# EAGLE design wigl_sch_motors (EAGLE 7.2.0)
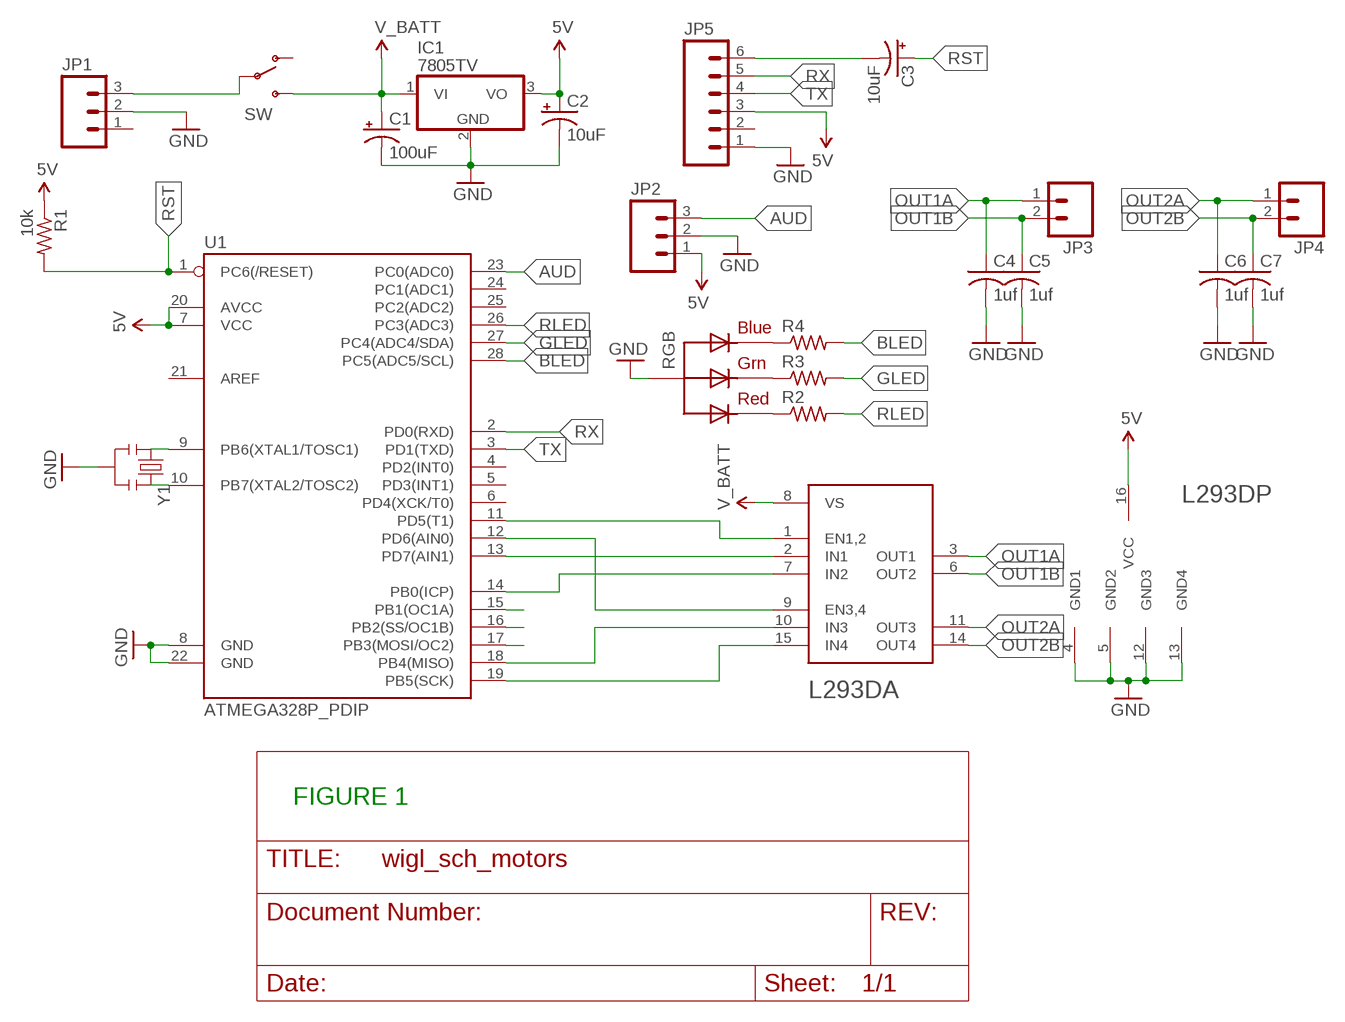
[diagram p0: schematic, sheet 1]

## Parts
C1  100uF  CAP_POLPTH1  [CPOL-RADIAL-100UF-25V]
C2  10uF  CAP_POLPTH1  [CPOL-RADIAL-100UF-25V]
C3  10uF  CAP_POLPTH1  [CPOL-RADIAL-100UF-25V]
C4  1uf  C-US025-025X050  [C025-025X050]
C5  1uf  C-US025-025X050  [C025-025X050]
C6  1uf  C-US025-025X050  [C025-025X050]
C7  1uf  C-US025-025X050  [C025-025X050]
IC1  7805TV  [TO220V]
JP1  M03LONGPADS  [1X03_LONGPADS]
JP2  M03LONGPADS  [1X03_LONGPADS]
JP3  M02LOCK_LONGPADS  [1X02_LOCK_LONGPADS]
JP4  M02LOCK_LONGPADS  [1X02_LOCK_LONGPADS]
JP5  M06LONGPADS  [1X06_LONGPADS]
L293D  L293D  [DIP16]
R1  10k  R-US_0204/2V  [0204V]
R2  R-US_0204/2V  [0204V]
R3  R-US_0204/2V  [0204V]
R4  R-US_0204/2V  [0204V]
RGB  RGBLED_CA-5MM  [LED5MMRGB]
SW  SWITCH-SPDTPTH  [SWITCH-SPDT]
U1  ATMEGA328P_PDIP  [DIL28-3]
Y1  RESONATORPTH  [RESONATOR-PTH]

## Nets
5V: C2.1(+) IC1.3(VO) JP2.1 JP5.3 L293D.16(P:VCC) R1.1 U1.7(VCC) U1.20(AVCC)
AUD: JP2.3 U1.23(PC0(ADC0))
BLED: R4.2 U1.28(PC5(ADC5/SCL))
GLED: R3.2 U1.27(PC4(ADC4/SDA))
GND: C1.2(-) C2.2(-) C4.2 C5.2 C6.2 C7.2 IC1.2(GND) JP1.2 JP2.2 L293D.4(P:GND1) L293D.5(P:GND2) L293D.12(P:GND3) L293D.13(P:GND4) RGB.2(VCC) U1.8(GND) U1.22(GND) Y1.2
N$1: JP1.3 SW.2(P)
N$2: R4.1 RGB.4(BLUE)
N$3: R3.1 RGB.3(GREEN)
N$4: C3.2(-) JP5.6
N$5: U1.9(PB6(XTAL1/TOSC1)) Y1.1
N$6: U1.10(PB7(XTAL2/TOSC2)) Y1.3
N$7: L293D.9(A:EN3,4) U1.12(PD6(AIN0))
N$8: R2.1 RGB.1(RED)
N$9: L293D.2(A:IN1) U1.13(PD7(AIN1))
N$10: L293D.7(A:IN2) U1.14(PB0(ICP))
N$11: U1.15(PB1(OC1A))
N$12: U1.16(PB2(SS/OC1B))
N$13: U1.17(PB3(MOSI/OC2))
N$14: L293D.10(A:IN3) U1.18(PB4(MISO))
N$15: L293D.15(A:IN4) U1.19(PB5(SCK))
N$16: L293D.1(A:EN1,2) U1.11(PD5(T1))
OUT1A: C4.1 JP3.1 L293D.3(A:OUT1)
OUT1B: C5.1 JP3.2 L293D.6(A:OUT2)
OUT2A: C6.1 JP4.1 L293D.11(A:OUT3)
OUT2B: C7.1 JP4.2 L293D.14(A:OUT4)
RLED: R2.2 U1.26(PC3(ADC3))
RST: C3.1(+) R1.2 U1.1(PC6(/RESET))
RX: JP5.5 U1.2(PD0(RXD))
TX: JP5.4 U1.3(PD1(TXD))
V_BATT: C1.1(+) IC1.1(VI) L293D.8(A:VS) SW.3(S)
Unconnected: JP1.1 JP5.1 JP5.2 SW.1(O) U1.4(PD2(INT0)) U1.5(PD3(INT1)) U1.6(PD4(XCK/T0)) U1.21(AREF) U1.24(PC1(ADC1)) U1.25(PC2(ADC2))

## Notes on the sheet
- FIGURE 1

## Library data of the parts
C1 C2 = SparkFun-Capacitors:CAP_POL: Capacitor Polarized These are standard SMD and PTH capacitors. Normally 10uF, 47uF, and 100uF in electrolytic and tantalum varieties. Always verify the external diameter of the through hole cap, it varies with capacity, voltage, and manufacturer. The EIA devices should be standard.
C3 = SparkFun-Passives:CAP_POL: Capacitor Polarized These are standard SMD and PTH capacitors. Normally 10uF, 47uF, and 100uF in electrolytic and tantalum varieties. Always verify the external diameter of the through hole cap, it varies with capacity, voltage, and manufacturer. The EIA devices should be standard.
C4-C7 = adafruit:C-US: CAPACITOR, American symbol
IC1 = linear:78*: Positive VOLTAGE REGULATOR Source: http://cache.national.com/ds/LM/LM78L05.pdf http://www.fairchildsemi.com/ds/LM/LM7805.pdf
JP1 JP2 = SparkFun-Connectors:M03: Header 3 Standard 3-pin 0.1" header. Use with straight break away headers (SKU : PRT-00116), right angle break away headers (PRT-00553), swiss pins (PRT-00743), machine pins (PRT-00117), and female headers (PRT-00115). Molex polarized connector foot print use with SKU : PRT-08232 with associated crimp pins and housings.
JP3 JP4 = SparkFun-Connectors:M02: Standard 2-pin 0.1" header. Use with - straight break away headers ( PRT-00116) - right angle break away headers (PRT-00553) - swiss pins (PRT-00743) - machine pins (PRT-00117) - female headers (PRT-00115) Molex polarized connector foot print use with: PRT-08233 with associated crimp pins and housings. 2.54_SCREWTERM for use with PRT-10571. 3.5mm Screw Terminal footprints for PRT-08084 5mm Screw Terminal footprints for use with PRT-08432
JP5 = SparkFun-Connectors:M06: Header 6 Standard 6-pin 0.1" header. Use with straight break away headers (SKU : PRT-00116), right angle break away headers (PRT-00553), swiss pins (PRT-00743), machine pins (PRT-00117), and female headers (PRT-00115). Molex polarized connector foot print use with SKU : PRT-08094 with associated crimp pins and housings. NOTES ON THE VARIANTS LOCK and LOCK_LONGPADS... This footprint was designed to help hold the alignment of a through-hole component (i.e. 6-pin header) while soldering it into place. You may notice that each hole has been shifted either up or down by 0.005 of an inch from it's more standard position (which is a perfectly straight line). This slight alteration caused the pins (the squares in the middle) to touch the edges of the holes. Because they are alternating, it causes a "brace" to hold the component in place. 0.005 has proven to be the perfect amount of "off-center" position when using our standard breakaway headers. Although looks a little odd when you look at the bare footprint, once you have a header in there, the alteration is very hard to notice. Also,if you push a header all the way into place, it is covered up entirely on the bottom side. This idea of altering the position of holes to aid alignment will be further integrated into the Sparkfun Library for other footprints. It can help hold any component with 3 or more connection pins.
L293D = ads:L293D: L293D Quad Half H-Bridge with integrated diodes
R1-R4 = adafruit:R-US_: RESISTOR, American symbol
RGB = adafruit:RGBLED_CA: RGB LED, common-anode 5MM Staggered pins 5mm Piranha package http://www.ladyada.net/library/pcb/eaglelibrary.html
SW = SparkFun-Electromechanical:SWITCH-SPDT: SPDT Switch Simple slide switch, Spark Fun Electronics SKU : COM-00102 DPDT SMT slide switch, AYZ0202, SWCH-08179
U1 = SparkFun-DigitalIC:ATMEGA328P_PDIP: uC used in the Arduino 32kb flash, 1k EEPROM, 2k SRAM This is the through-hole version of this chip.
Y1 = SparkFun-FreqCtrl:RESONATOR: Resonator Small SMD resonator. Used, eg, on the Arduino Pro/ Pro Mini boards. 8MHz- XTAL-08895 16MHz- XTAL-08900

## Net classes
0 default: width 0.305 mm, drill 0.508 mm, clearance 0.254 mm

## Board
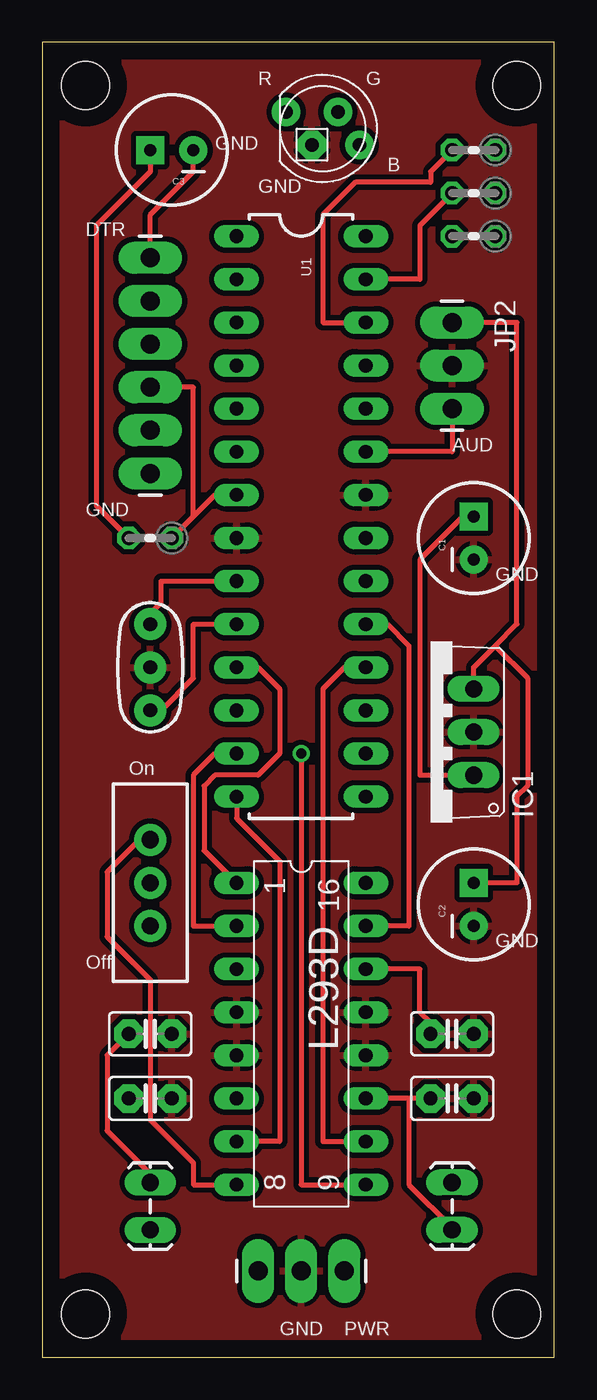
[diagram p1: board, top side]
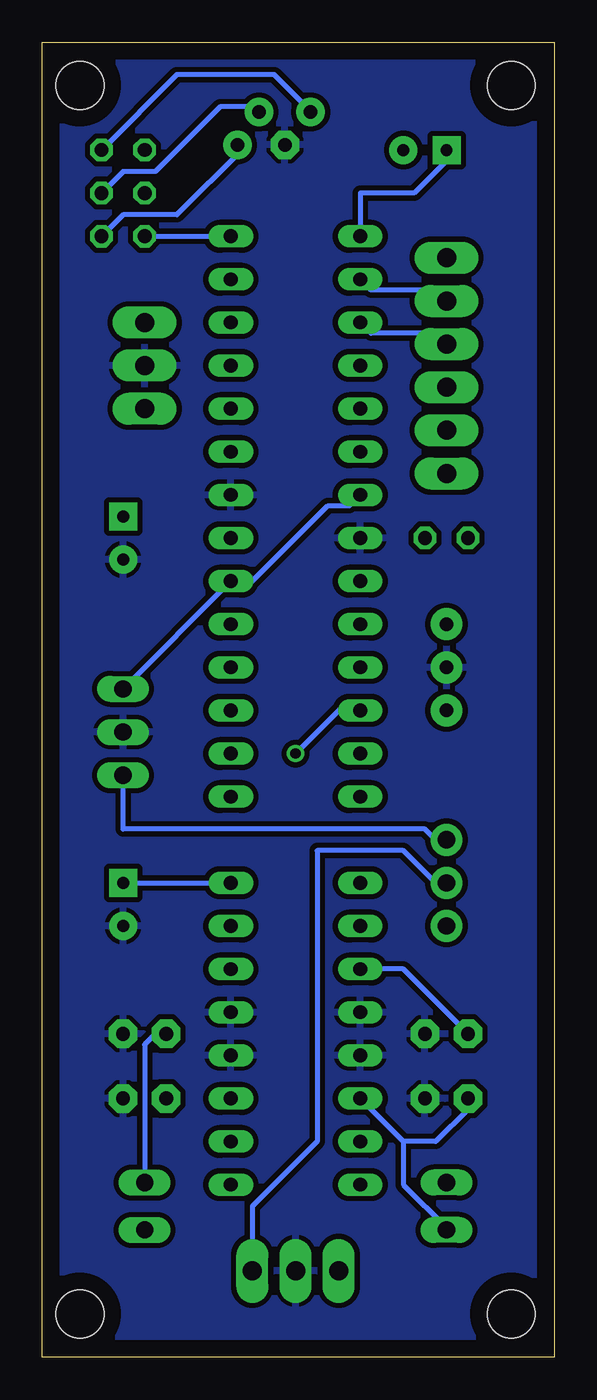
[diagram p2: board, bottom side, seen from below]

Size 30.15 x 77.46 mm. Coordinates in mm from the lower left corner, seen from the top.
Outline: 0,0 30.15,0 30.15,77.46 0,77.46 0,0
Copper layers (1*16): Top 0.035mm / dielectric 1.5mm / Bottom 0.035mm
Design rules "default": minimum track width 10mil, minimum drill 24mil, track to track 8mil, track to pad 8mil, pad to pad 8mil, via to via 8mil, smd to smd 8mil, copper to edge 40mil, drill to drill 8mil, minimum pad ring 10mil, minimum via ring 8mil, stop-mask expansion 4mil, vias tented up to drill 0mil, thermal gap 10mil
Holes 2.8 mm at 2.54,74.93 27.94,74.93 27.94,2.54 2.54,2.54

### Footprints (pad centres in the part's own frame; a part is rotated, then mirrored left to right if it is on the bottom)
CPOL-RADIAL-100UF-25V = drill 0.7 pad 1.651 square: 1 1.27,0 | drill 0.7 pad 1.651: 2 -1.27,0
C025-025X050 = drill 0.813 pad 1.676 octagon: 1 -1.27,0; 2 1.27,0
TO220V = drill 1.016 long: 1 -2.54,-2.54; 2 0,-2.54; 3 2.54,-2.54
1X03_LONGPADS = drill 1.118 pad 1.88 long: 1 0,0; 2 2.54,0; 3 5.08,0
1X02_LOCK_LONGPADS = drill 1.016 long: 1 -0.127,0; 2 2.667,0
1X06_LONGPADS = drill 1.118 pad 1.88 long: 1 0,0; 2 2.54,0; 3 5.08,0; 4 7.62,0; 5 10.16,0; 6 12.7,0
DIP16 = drill 0.813 long: 1 -8.89,-3.81; 2 -6.35,-3.81; 3 -3.81,-3.81; 4 -1.27,-3.81; 5 1.27,-3.81; 6 3.81,-3.81; 7 6.35,-3.81; 8 8.89,-3.81; 9 8.89,3.81; 10 6.35,3.81; 11 3.81,3.81; 12 1.27,3.81; 13 -1.27,3.81; 14 -3.81,3.81; 15 -6.35,3.81; 16 -8.89,3.81
0204V = drill 0.813 octagon: 1 -1.27,0; 2 1.27,0
LED5MMRGB = drill 0.8 pad 1.676: 1 -2.159,0.968; 3 0.889,0.968; 4 2.159,-0.968 | drill 0.8 pad 1.676 octagon: 2 -0.635,-0.968
SWITCH-SPDT = drill 1.016 pad 1.88: 1 0,2.54; 2 0,0; 3 0,-2.54
DIL28-3 = drill 0.813 long: 1 -16.51,-3.81; 2 -13.97,-3.81; 3 -11.43,-3.81; 4 -8.89,-3.81; 5 -6.35,-3.81; 6 -3.81,-3.81; 7 -1.27,-3.81; 8 1.27,-3.81; 9 3.81,-3.81; 10 6.35,-3.81; 11 8.89,-3.81; 12 11.43,-3.81; 13 13.97,-3.81; 14 16.51,-3.81; 15 16.51,3.81; 16 13.97,3.81; 17 11.43,3.81; 18 8.89,3.81; 19 6.35,3.81; 20 3.81,3.81; 21 1.27,3.81; 22 -1.27,3.81; 23 -3.81,3.81; 24 -6.35,3.81; 25 -8.89,3.81; 26 -11.43,3.81; 27 -13.97,3.81; 28 -16.51,3.81
RESONATOR-PTH = drill 0.8 pad 1.88: 1 -2.54,0; 2 0,0; 3 2.54,0

### Placement (x,y rotation side)
C1  25.4,48.26 90 top
C2  25.4,26.67 90 top
C3  7.62,71.12 180 top
C4  6.35,19.05 0 top
C5  6.35,15.24 0 top
C6  24.13,15.24 0 top
C7  24.13,19.05 0 top
IC1  22.86,36.83 90 top
JP1  12.7,5.08 0 top
JP2  24.13,60.96 270 top
JP3  6.35,10.16 270 top
JP4  24.13,7.62 90 top
JP5  6.35,52.07 90 top
L293D  15.24,19.05 270 top
R1  6.35,48.26 180 top
R2  25.4,71.12 180 top
R3  25.4,68.58 180 top
R4  25.4,66.04 180 top
RGB  16.51,72.39 0 top
SW  6.35,27.94 180 top
U1  15.24,49.53 270 top
Y1  6.35,40.64 270 top

### Tracks (layer width: path | path; a pad name or v marks a point on that pad's centre or on a via)
5V
  Top 0.305: 8.89,49.53 10.16,50.8 U1.7 | 8.89,49.53 R1.1 | JP5.3 8.89,57.15 8.89,49.53 | JP2.1 27.94,60.96 27.94,43.18 26.67,41.91 | 26.67,41.91 25.4,40.64 IC1.3 | C2.1 27.94,27.94 27.94,33.02 28.58,33.66 28.58,40.01 26.67,41.91
  Bottom 0.305: C2.1 L293D.16 | IC1.3 U1.20 17.78,45.72 13.33,50.16 12.06,50.16 U1.7
AUD
  Top 0.305: U1.23 24.13,53.34 JP2.3
BLED
  Bottom 0.305: R4.2 U1.28
GLED
  Top 0.305: U1.27 22.23,63.5 22.23,66.67 R3.2
GND
  pour Top (isolate 0.305): -2.54,77.47 33.02,77.47 33.02,0 -2.54,0
  pour Bottom (isolate 0.305): -2.54,77.47 33.02,77.47 33.02,0 -2.54,0
N$1
  Bottom 0.305: JP1.3 17.78,8.89 13.97,12.7 13.97,29.84 8.89,29.84 6.98,27.94 SW.2
N$2
  Bottom 0.305: R4.1 25.4,67.31 22.23,67.31 18.41,71.12 RGB.4
N$3
  Bottom 0.305: R3.1 25.4,69.85 23.49,69.85 19.69,73.66 17.78,73.66 RGB.3
N$4
  Top 0.305: C3.2 8.89,69.85 6.35,67.31 JP5.6
N$5
  Top 0.305: U1.9 6.98,45.72 6.98,44.45 6.35,43.82 Y1.1
N$6
  Top 0.305: U1.10 8.89,43.18 8.89,40.01 6.98,38.1 Y1.3
N$7  (via drill 0.61)
  Top 0.305: L293D.9 15.24,10.16 v15.24,35.56
  Bottom 0.305: v15.24,35.56 12.7,38.1 U1.12
N$8
  Bottom 0.305: R2.1 22.23,75.56 16.51,75.56 14.6,73.66 RGB.1
N$9
  Top 0.305: L293D.2 8.89,25.4 8.89,34.29 10.16,35.56 U1.13
N$10
  Top 0.305: L293D.7 13.97,12.7 13.97,29.21 11.43,31.75 U1.14
N$14
  Top 0.305: L293D.10 16.51,12.7 16.51,39.37 17.78,40.64 U1.18
N$15
  Top 0.305: L293D.15 21.59,25.4 21.59,41.91 20.32,43.18 U1.19
N$16
  Top 0.305: L293D.1 9.53,29.84 9.53,33.66 10.16,34.29 12.7,34.29 13.97,35.56 13.97,39.37 12.7,40.64 U1.11
OUT1A
  Top 0.305: C4.1 3.81,17.78 3.81,13.33 6.35,10.79 JP3.1
  Bottom 0.305: L293D.3 8.89,22.86 C4.1
OUT1B
  Bottom 0.305: 8.89,12.7 L293D.6 | 8.89,12.7 6.98,12.7 5.08,14.6 C5.1 | 8.89,12.7 8.89,10.16 6.35,7.62 JP3.2
OUT2A
  Top 0.305: C6.1 21.59,15.24 | 21.59,15.24 L293D.11 | 21.59,15.24 21.59,10.16 24.13,7.62 JP4.1
OUT2B
  Top 0.305: L293D.14 22.23,22.86 22.23,20.32 22.86,19.69 C7.1
  Bottom 0.305: JP4.2 24.13,18.41 23.49,19.05 C7.1
RLED
  Top 0.305: U1.26 16.51,60.96 16.51,67.31 18.41,69.22 22.86,69.22 22.86,69.85 R2.2
RST
  Top 0.305: R1.2 3.18,50.16 3.18,66.67 6.35,69.85 C3.1
  Bottom 0.305: U1.1 11.43,68.58 8.26,68.58 6.35,70.48 C3.1
RX
  Bottom 0.305: U1.2 10.79,62.86 6.98,62.86 JP5.5
TX
  Bottom 0.305: U1.3 10.79,60.33 6.98,60.33 JP5.4
V_BATT
  Top 0.305: IC1.1 22.23,34.29 22.23,46.99 24.77,49.53 C1.1 | L293D.8 8.89,10.16 8.89,11.43 6.35,13.97 6.35,22.23 3.81,24.77 3.81,28.58 5.71,30.48 SW.3
  Bottom 0.305: IC1.1 25.4,31.12 7.62,31.12 6.98,30.48 SW.3

### Text on the board
tPlace: R | G | GND | B | GND | GND | GND | GND
tNames: DTR | AUD | On | Off | GND | PWR